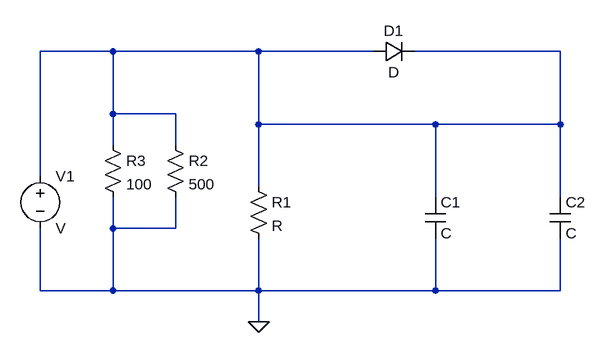
[diagram p0: schematic formatted_circuit.asc]
formatted_circuit.asc, the LTspice schematic file:
Version 4
SHEET 1 880 1280
WIRE 128 272 16 272
WIRE 352 272 128 272
WIRE 528 272 352 272
WIRE 816 272 592 272
WIRE 128 368 128 272
WIRE 224 368 128 368
WIRE 352 384 352 272
WIRE 624 384 352 384
WIRE 816 384 816 272
WIRE 816 384 624 384
WIRE 128 416 128 368
WIRE 224 416 224 368
WIRE 16 464 16 272
WIRE 352 480 352 384
WIRE 624 496 624 384
WIRE 816 496 816 384
WIRE 128 544 128 496
WIRE 224 544 224 496
WIRE 224 544 128 544
WIRE 16 640 16 544
WIRE 128 640 128 544
WIRE 128 640 16 640
WIRE 352 640 352 560
WIRE 352 640 128 640
WIRE 624 640 624 560
WIRE 624 640 352 640
WIRE 816 640 816 560
WIRE 816 640 624 640
WIRE 352 688 352 640
FLAG 352 688 0
SYMBOL res 336 464 R0
SYMATTR InstName R1
SYMBOL cap 608 496 R0
SYMATTR InstName C1
SYMBOL cap 800 496 R0
SYMATTR InstName C2
SYMBOL diode 528 288 R270
WINDOW 0 32 32 VTop 2
WINDOW 3 0 32 VBottom 2
SYMATTR InstName D1
SYMBOL voltage 16 448 R0
SYMATTR InstName V1
SYMBOL res 208 400 R0
SYMATTR InstName R2
SYMATTR Value 500
SYMBOL res 112 400 R0
SYMATTR InstName R3
SYMATTR Value 100

The netlist it stands for:
* formatted_circuit.asc
R1 N001 0 R
C1 N001 0 C
C2 N001 0 C
D1 N001 N001 D
V1 N001 0 V
R2 N001 0 500
R3 N001 0 100
.model D D
.lib standard.dio
.backanno
.end